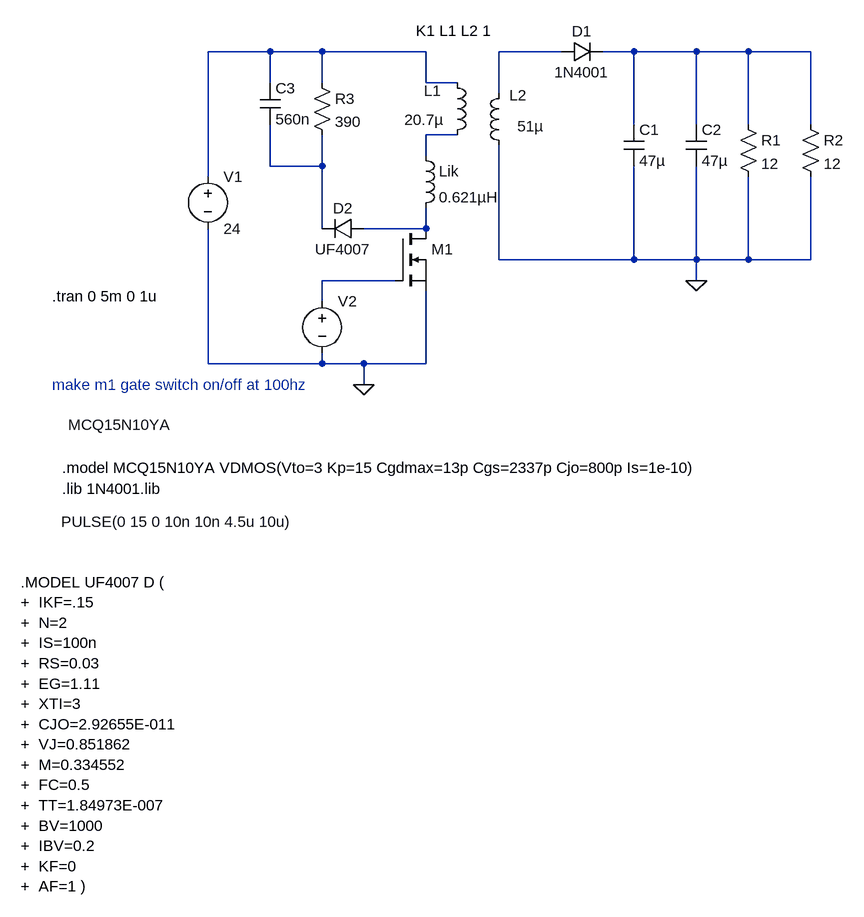
[diagram p0: schematic flyback.asc]
flyback.asc, the LTspice schematic file:
Version 4.1
SHEET 1 1064 1156
WIRE 176 -96 80 -96
WIRE 256 -96 176 -96
WIRE 416 -96 256 -96
WIRE 624 -96 528 -96
WIRE 736 -96 688 -96
WIRE 832 -96 736 -96
WIRE 912 -96 832 -96
WIRE 1008 -96 912 -96
WIRE 176 -48 176 -96
WIRE 256 -48 256 -96
WIRE 416 -48 416 -96
WIRE 464 -48 416 -48
WIRE 528 -32 528 -96
WIRE 736 16 736 -96
WIRE 832 16 832 -96
WIRE 912 16 912 -96
WIRE 1008 16 1008 -96
WIRE 464 32 416 32
WIRE 416 64 416 32
WIRE 176 80 176 16
WIRE 256 80 256 32
WIRE 256 80 176 80
WIRE 80 96 80 -96
WIRE 256 176 256 80
WIRE 416 176 416 144
WIRE 416 176 320 176
WIRE 528 224 528 48
WIRE 736 224 736 80
WIRE 736 224 528 224
WIRE 832 224 832 80
WIRE 832 224 736 224
WIRE 912 224 912 96
WIRE 912 224 832 224
WIRE 1008 224 1008 96
WIRE 1008 224 912 224
WIRE 368 256 256 256
WIRE 832 256 832 224
WIRE 256 288 256 256
WIRE 80 384 80 176
WIRE 256 384 256 368
WIRE 256 384 80 384
WIRE 320 384 256 384
WIRE 416 384 416 272
WIRE 416 384 320 384
WIRE 320 416 320 384
FLAG 320 416 0
FLAG 832 256 0
SYMBOL voltage 80 80 R0
SYMATTR InstName V1
SYMATTR Value 24
SYMBOL ind 448 48 M180
WINDOW 0 -35 84 Left 2
WINDOW 3 -65 39 Left 2
SYMATTR InstName L1
SYMATTR Value 20.7µ
SYMATTR Type ind
SYMATTR SpiceLine Rser=1m
SYMBOL ind 544 -48 M0
WINDOW 0 -27 19 Left 2
WINDOW 3 -53 67 Left 2
SYMATTR InstName L2
SYMATTR Value 51µ
SYMATTR Type ind
SYMATTR SpiceLine Rser=1m
SYMBOL nmos 368 176 R0
WINDOW 3 -503 302 Left 2
SYMATTR InstName M1
SYMATTR Value MCQ15N10YA
SYMBOL diode 624 -80 R270
WINDOW 0 32 32 VTop 2
WINDOW 3 0 32 VBottom 2
SYMATTR InstName D1
SYMATTR Value 1N4001
SYMATTR Prefix X
SYMBOL voltage 256 272 R0
WINDOW 3 -402 355 Left 2
SYMATTR Value PULSE(0 15 0 10n 10n 4.5u 10u)
SYMATTR InstName V2
SYMBOL cap 720 16 R0
SYMATTR InstName C1
SYMATTR Value 47µ
SYMBOL cap 816 16 R0
SYMATTR InstName C2
SYMATTR Value 47µ
SYMBOL res 896 0 R0
SYMATTR InstName R1
SYMATTR Value 12
SYMBOL res 992 0 R0
SYMATTR InstName R2
SYMATTR Value 12
SYMBOL res 240 -64 R0
SYMATTR InstName R3
SYMATTR Value 390
SYMBOL cap 160 -48 R0
SYMATTR InstName C3
SYMATTR Value 560n
SYMBOL ind 400 48 R0
SYMATTR InstName Lik
SYMATTR Value 0.621µH
SYMBOL diode 320 160 R90
WINDOW 0 0 32 VBottom 2
WINDOW 3 32 32 VTop 2
SYMATTR InstName D2
SYMATTR Value UF4007
TEXT 400 -128 Left 2 !K1 L1 L2 1
TEXT -160 416 Left 2 ;make m1 gate switch on/off at 100hz
TEXT -160 280 Left 2 !.tran 0 5m 0 1u
TEXT -144 544 Left 2 !.model MCQ15N10YA VDMOS(Vto=3 Kp=15 Cgdmax=13p Cgs=2337p Cjo=800p Is=1e-10)
TEXT -144 576 Left 2 !.lib 1N4001.lib
TEXT -208 720 Left 2 !.MODEL UF4007 D (\n+  IKF=.15\n+  N=2\n+  IS=100n\n+  RS=0.03\n+  EG=1.11\n+  XTI=3\n+  CJO=2.92655E-011\n+  VJ=0.851862\n+  M=0.334552\n+  FC=0.5\n+  TT=1.84973E-007\n+  BV=1000\n+  IBV=0.2\n+  KF=0\n+  AF=1 )

The netlist it stands for:
* flyback.asc
V1 N001 0 24
L1 N004 N001 20.7µ Rser=1m
L2 N002 0 51µ Rser=1m
M1 N006 N007 0 0 MCQ15N10YA
X§D1 N002 N003 1N4001  ; pins + -
V2 N007 0 PULSE(0 15 0 10n 10n 4.5u 10u)
C1 N003 0 47µ
C2 N003 0 47µ
R1 N003 0 12
R2 N003 0 12
R3 N001 N005 390
C3 N001 N005 560n
Lik N004 N006 0.621µH
D2 N006 N005 UF4007
.model D D
.lib standard.dio
.model NMOS NMOS
.model PMOS PMOS
.lib standard.mos
K1 L1 L2 1
* make m1 gate switch on/off at 100hz
.tran 0 5m 0 1u
.model MCQ15N10YA VDMOS(Vto=3 Kp=15 Cgdmax=13p Cgs=2337p Cjo=800p Is=1e-10)
.lib 1N4001.lib
.MODEL UF4007 D (
+  IKF=.15
+  N=2
+  IS=100n
+  RS=0.03
+  EG=1.11
+  XTI=3
+  CJO=2.92655E-011
+  VJ=0.851862
+  M=0.334552
+  FC=0.5
+  TT=1.84973E-007
+  BV=1000
+  IBV=0.2
+  KF=0
+  AF=1 )
.backanno
.end